# Altium schematic sheet Cell_121_sheet_2.SchDoc
size 420 x 297 mm; DocumentNumber: Фг3.089.121 Э3; SheetNumber: 2; SheetTotal: 4
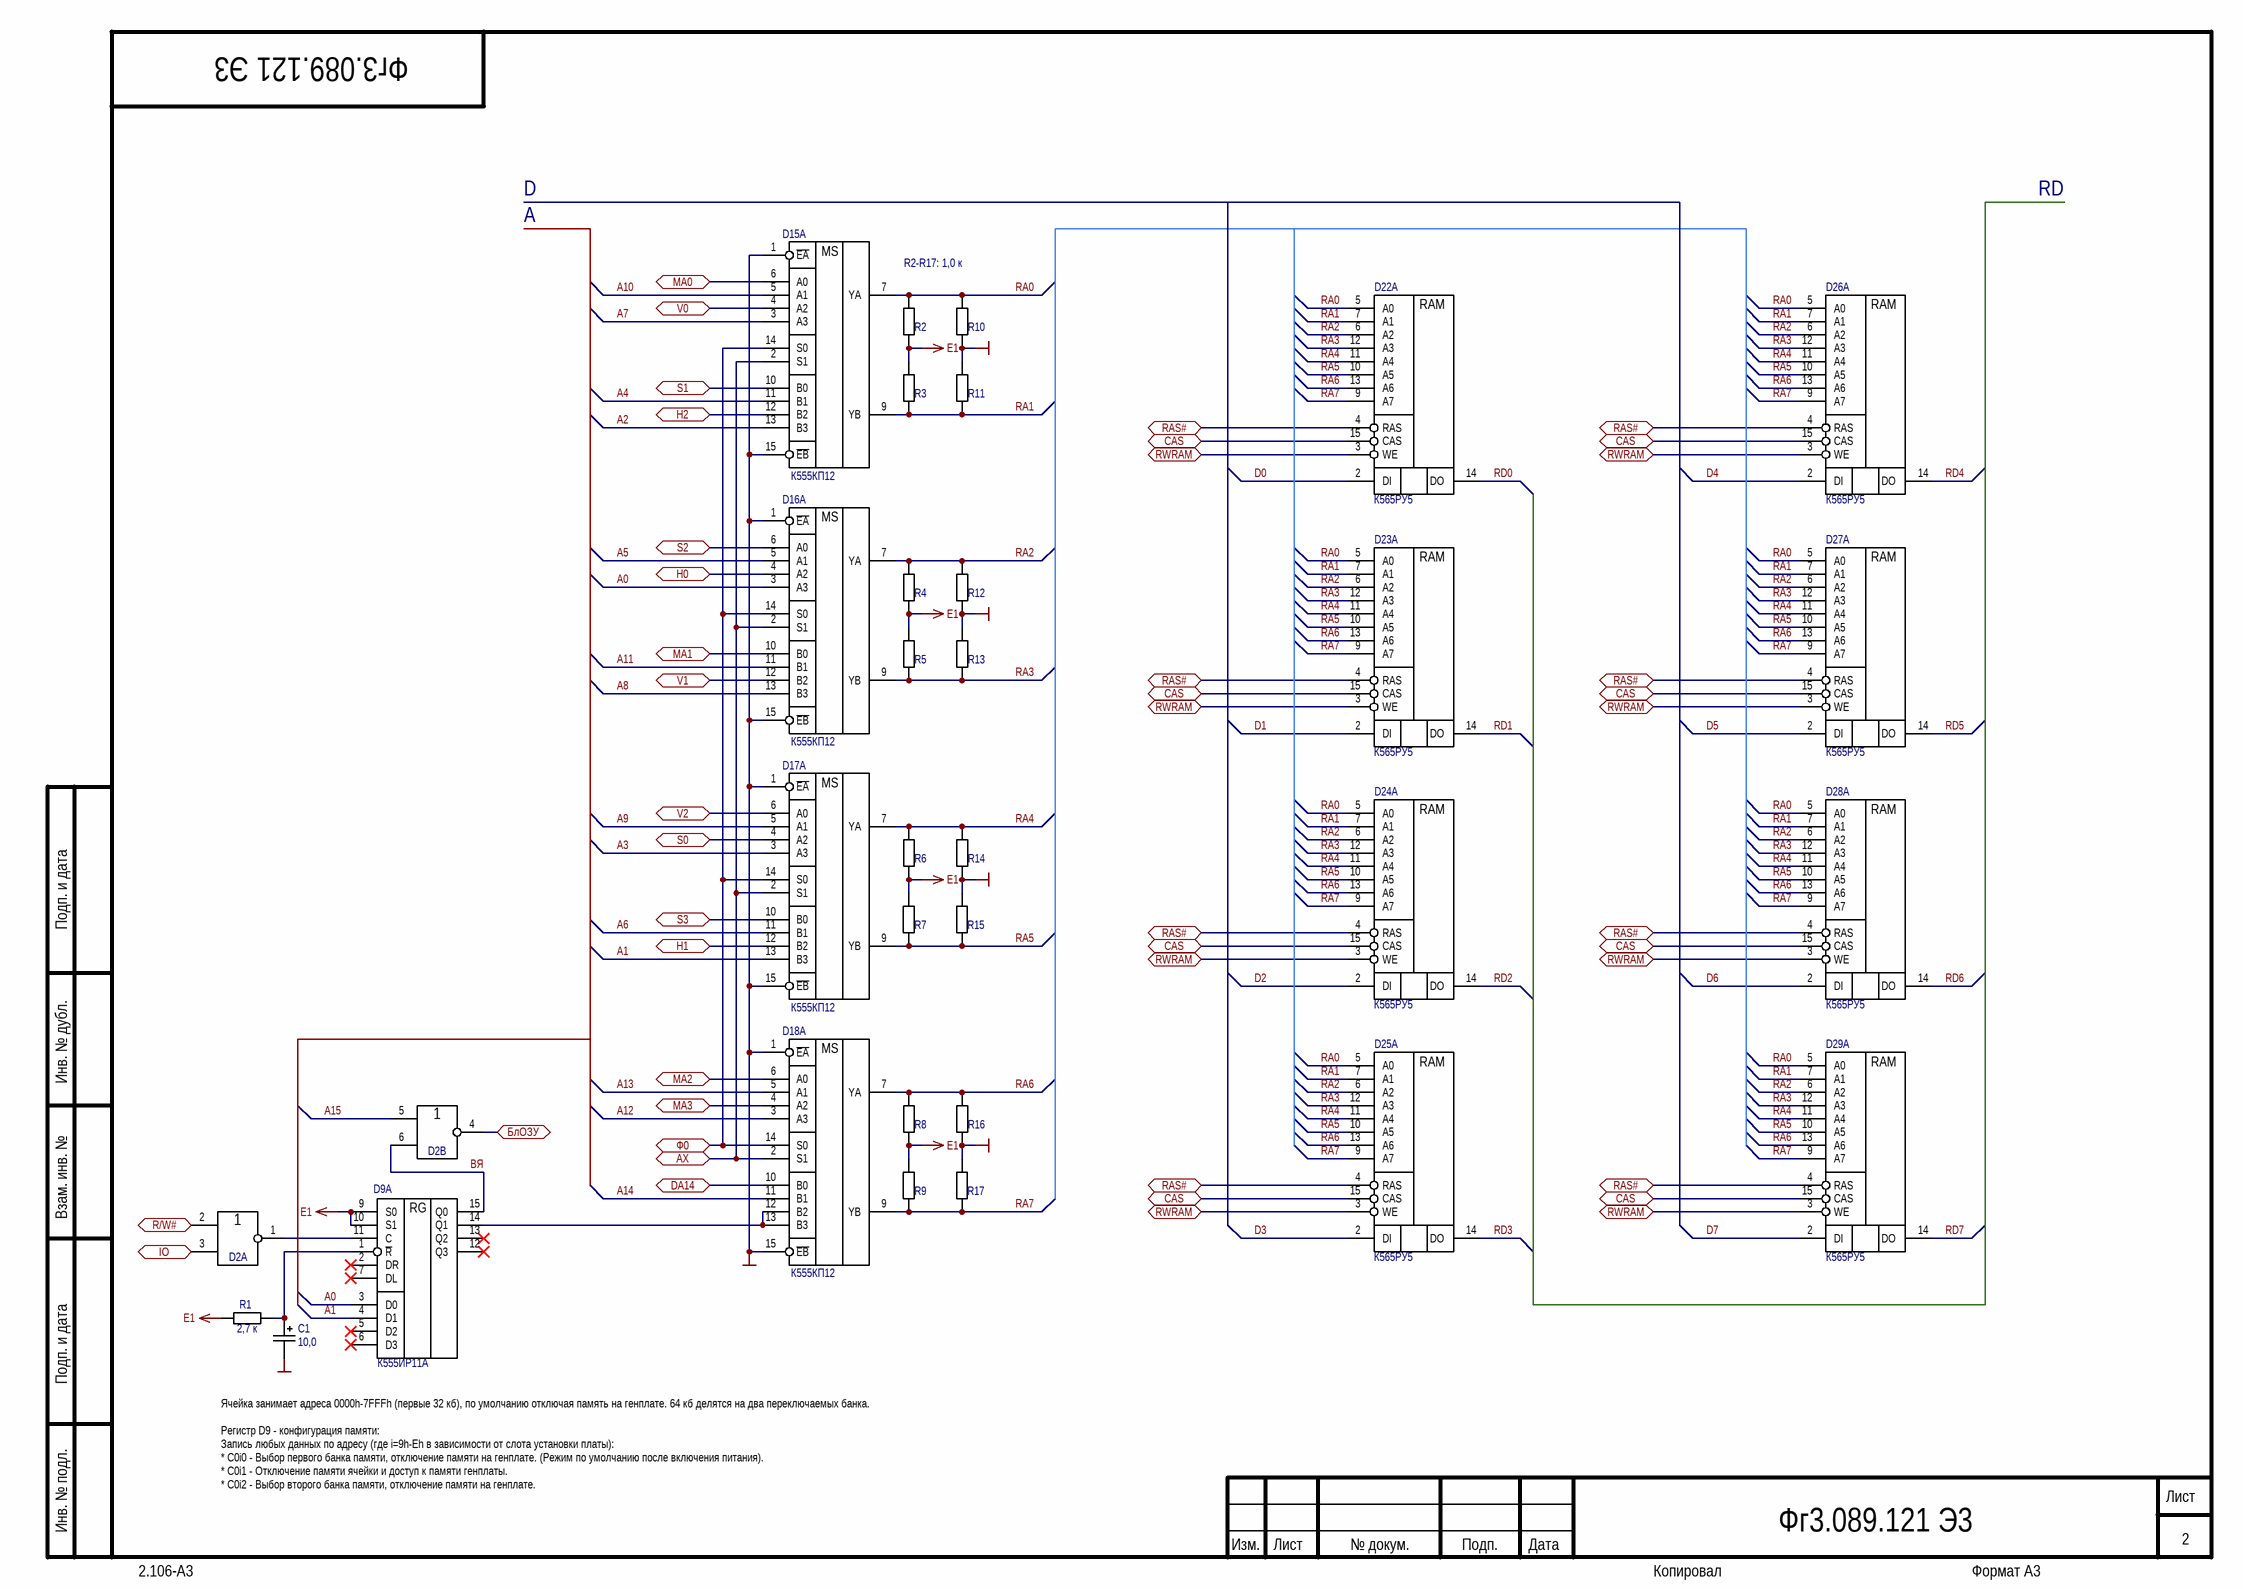
[diagram p0: Cell_121_sheet_2.SchDoc]

## Parts
C1  10,0  [CP25]
D2  К555ЛЕ1  [201.14]  (value not drawn)  (parts A,B of 5)
D9  К555ИР11А  [201.16]  (part A of 2)
D15  К555КП12  [201.16]  (part A of 2)
D16  К555КП12  [201.16]  (part A of 2)
D17  К555КП12  [201.16]  (part A of 2)
D18  К555КП12  [201.16]  (part A of 2)
D22  К565РУ5  [201.16]  (part A of 2)
D23  К565РУ5  [201.16]  (part A of 2)
D24  К565РУ5  [201.16]  (part A of 2)
D25  К565РУ5  [201.16]  (part A of 2)
D26  К565РУ5  [201.16]  (part A of 2)
D27  К565РУ5  [201.16]  (part A of 2)
D28  К565РУ5  [201.16]  (part A of 2)
D29  К565РУ5  [201.16]  (part A of 2)
R1  2,7 к  [R10]
R2  1 к  [R10]  (value not drawn)
R3  1 к  [R10]  (value not drawn)
R4  1 к  [R10]  (value not drawn)
R5  1 к  [R10]  (value not drawn)
R6  1 к  [R10]  (value not drawn)
R7  1 к  [R10]  (value not drawn)
R8  1 к  [R10]  (value not drawn)
R9  1 к  [R10]  (value not drawn)
R10  1 к  [R10]  (value not drawn)
R11  1 к  [R10]  (value not drawn)
R12  1 к  [R10]  (value not drawn)
R13  1 к  [R10]  (value not drawn)
R14  1 к  [R10]  (value not drawn)
R15  1 к  [R10]  (value not drawn)
R16  1 к  [R10]  (value not drawn)
R17  1 к  [R10]  (value not drawn)

## Ports
AX (bidir, see Cell_121_sheet_1[2B], Cell_121_sheet_1[2C]), CAS (bidir, see Cell_121_sheet_1[1A], Cell_121_sheet_1[2B], Cell_121_sheet_1[2D], Cell_121_sheet_2[3B], Cell_121_sheet_2[3C], Cell_121_sheet_2[3D]), DA14 (bidir, see Cell_121_sheet_3[4C]), H0 (bidir, see Cell_121_sheet_1[3A]), H1 (bidir, see Cell_121_sheet_1[3A]), H2 (bidir, see Cell_121_sheet_1[3A], Cell_121_sheet_1[3C]), IO (bidir, see Cell_121_sheet_1[1B]), MA0 (bidir, see Cell_121_sheet_1[4B]), MA1 (bidir, see Cell_121_sheet_1[4B]), MA2 (bidir, see Cell_121_sheet_1[4B]), MA3 (bidir, see Cell_121_sheet_1[4B]), R/W# (bidir, see Cell_121_sheet_1[1B], Cell_121_sheet_1[1D], Cell_121_sheet_1[2C]), RAS# (bidir, see Cell_121_sheet_1[2B], Cell_121_sheet_2[3B], Cell_121_sheet_2[3C], Cell_121_sheet_3[1A], Cell_121_sheet_3[1B]), RWRAM (bidir, see Cell_121_sheet_1[2C], Cell_121_sheet_2[3B], Cell_121_sheet_2[3C], Cell_121_sheet_2[3D]), S0 (bidir, see Cell_121_sheet_1[4A]), S1 (bidir, see Cell_121_sheet_1[4A]), S2 (bidir, see Cell_121_sheet_1[4A]), S3 (bidir, see Cell_121_sheet_1[4A]), V0 (bidir, see Cell_121_sheet_1[3B], Cell_121_sheet_1[3C]), V1 (bidir, see Cell_121_sheet_1[3B]), V2 (bidir, see Cell_121_sheet_1[3B], Cell_121_sheet_1[3C], Cell_121_sheet_3[4C]), БлОЗУ (bidir, see Cell_121_sheet_1[1B], Cell_121_sheet_1[2C]), Ф0 (bidir, see Cell_121_sheet_1[2C], Cell_121_sheet_1[2D])

## Nets
E1: D9.9(S0) D9.10(S1) R1.2 R2.2 R3.1 R4.2 R5.1 R6.2 R7.2 R8.2 R9.2
GND: C1.2 D15.1(~{EA}) D15.15(~{EB}) D16.1(~{EA}) D16.15(~{EB}) D17.1(~{EA}) D17.15(~{EB}) D18.1(~{EA}) D18.15(~{EB}) R10.2 R11.1 R12.2 R13.1 R14.2 R15.2 R16.2 R17.2
A0: D9.3(D0) D16.3(A3)
A1: D9.4(D1) D17.13(B3)
A2: D15.13(B3)
A3: D17.3(A3)
A4: D15.11(B1)
A5: D16.5(A1)
A6: D17.11(B1)
A7: D15.3(A3)
A8: D16.13(B3)
A9: D17.5(A1)
A10: D15.5(A1)
A11: D16.11(B1)
A12: D18.3(A3)
A13: D18.5(A1)
A14: D18.11(B1)
A15: D2.5(A)
AX: D15.2(S1) D16.2(S1) D17.2(S1) D18.2(S1) ; port AX
CAS: D22.15(CAS) D23.15(CAS) D24.15(CAS) D25.15(CAS) D26.15(CAS) D27.15(CAS) D28.15(CAS) D29.15(CAS) ; port CAS
D0: D22.2(DI)
D1: D23.2(DI)
D2: D24.2(DI)
D3: D25.2(DI)
D4: D26.2(DI)
D5: D27.2(DI)
D6: D28.2(DI)
D7: D29.2(DI)
DA14: D18.10(B0) ; port DA14
H0: D16.4(A2) ; port H0
H1: D17.12(B2) ; port H1
H2: D15.12(B2) ; port H2
IO: D2.3(B) ; port IO
MA0: D15.6(A0) ; port MA0
MA1: D16.10(B0) ; port MA1
MA2: D18.6(A0) ; port MA2
MA3: D18.4(A2) ; port MA3
R/W#: D2.2(A) ; port R/W#
RA0: D15.7(YA) D22.5(A0) D23.5(A0) D24.5(A0) D25.5(A0) D26.5(A0) D27.5(A0) D28.5(A0) D29.5(A0) R2.1 R10.1
RA1: D15.9(YB) D22.7(A1) D23.7(A1) D24.7(A1) D25.7(A1) D26.7(A1) D27.7(A1) D28.7(A1) D29.7(A1) R3.2 R11.2
RA2: D16.7(YA) D22.6(A2) D23.6(A2) D24.6(A2) D25.6(A2) D26.6(A2) D27.6(A2) D28.6(A2) D29.6(A2) R4.1 R12.1
RA3: D16.9(YB) D22.12(A3) D23.12(A3) D24.12(A3) D25.12(A3) D26.12(A3) D27.12(A3) D28.12(A3) D29.12(A3) R5.2 R13.2
RA4: D17.7(YA) D22.11(A4) D23.11(A4) D24.11(A4) D25.11(A4) D26.11(A4) D27.11(A4) D28.11(A4) D29.11(A4) R6.1 R14.1
RA5: D17.9(YB) D22.10(A5) D23.10(A5) D24.10(A5) D25.10(A5) D26.10(A5) D27.10(A5) D28.10(A5) D29.10(A5) R7.1 R15.1
RA6: D18.7(YA) D22.13(A6) D23.13(A6) D24.13(A6) D25.13(A6) D26.13(A6) D27.13(A6) D28.13(A6) D29.13(A6) R8.1 R16.1
RA7: D18.9(YB) D22.9(A7) D23.9(A7) D24.9(A7) D25.9(A7) D26.9(A7) D27.9(A7) D28.9(A7) D29.9(A7) R9.1 R17.1
RAS#: D22.4(RAS) D23.4(RAS) D24.4(RAS) D25.4(RAS) D26.4(RAS) D27.4(RAS) D28.4(RAS) D29.4(RAS) ; port RAS#
RD0: D22.14(DO)
RD1: D23.14(DO)
RD2: D24.14(DO)
RD3: D25.14(DO)
RD4: D26.14(DO)
RD5: D27.14(DO)
RD6: D28.14(DO)
RD7: D29.14(DO)
RWRAM: D22.3(WE) D23.3(WE) D24.3(WE) D25.3(WE) D26.3(WE) D27.3(WE) D28.3(WE) D29.3(WE) ; port RWRAM
S0: D17.4(A2) ; port S0
S1: D15.10(B0) ; port S1
S2: D16.6(A0) ; port S2
S3: D17.10(B0) ; port S3
V0: D15.4(A2) ; port V0
V1: D16.12(B2) ; port V1
V2: D17.6(A0) ; port V2
БлОЗУ: D2.4(~{O}) ; port БлОЗУ
ВЯ: D2.6(B) D9.15(Q0)
Ф0: D15.14(S0) D16.14(S0) D17.14(S0) D18.14(S0) ; port Ф0
NetC1_1: C1.1 D9.1(~{R}) R1.1
NetD2_1: D2.1(~{O}) D9.11(C)
NetD9_14: D9.14(Q1) D18.12(B2) D18.13(B3)

Not connected (* = marked no-connect by the designer): D9 2(DR)* 5(D2)* 6(D3)* 7(DL)* 12(Q3)* 13(Q2)*

## Notes on the sheet
- A
- D
- RD
- R2-R17: 1,0 к
- Ячейка занимает адреса 0000h-7FFFh (первые 32 кб), по умолчанию отключая память на генплате. 64 кб делятся на два переключаемых банка.
  Регистр D9 - конфигурация памяти:
  Запись любых данных по адресу (где i=9h-Eh в зависимости от слота установки платы):
  * C0i0 - Выбор первого банка памяти, отключение памяти на генплате. (Режим по умолчанию после включения питания).
  * C0i1 - Отключение памяти ячейки и доступ к памяти генплаты.
  * C0i2 - Выбор второго банка памяти, отключение памяти на генплате.
- Подп. и дата
- Инв. № дубл.
- Взам. инв. №
- Инв. № подл.
- Изм.
- Лист
- № докум.
- Подп.
- Дата
- 2.106-A3
- Копировал
- Формат А3
- (in symbol К555ИР11А, part A) RG
- (in symbol К555КП12, part A) MS
- (in symbol К565РУ5, part A) RAM

## Library data of the parts
C1 = К53-14: Value: 10,0
D2 = К555ЛЕ1: ManufacturerPartNumber: К555ЛА3
D9 = К555ИР11А: ManufacturerPartNumber: КР531ИЕ17
D15-D18 = К555КП12: ManufacturerPartNumber: К155КП2
R1-R17 = С2-23: Резистор
  R1: Value: 2,7 к
  R2-R17: Value: 1 к
D22-D29 = К565РУ5: ManufacturerPartNumber: К565РУ5